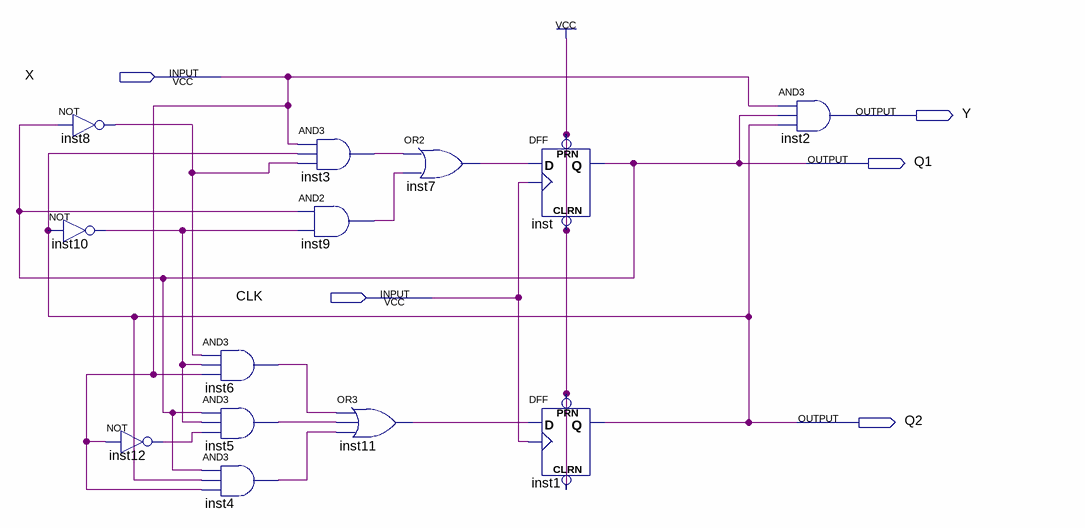
[diagram p0: schematic sheet]
// Quartus schematic SeqDet1101.bdf as structural Verilog: 13 symbols, 5 pins
module SeqDet1101 (
  input  X,
  input  CLK,
  output Y,
  output Q1,
  output Q2
);

  wire inst3_out, inst4_out, inst5_out, inst6_out, inst7_out, inst8_out, inst9_out, inst10_out, inst11_out,
       inst12_out;

  not inst8 (inst8_out, Q1);
  not inst10 (inst10_out, Q2);
  not inst12 (inst12_out, X);
  and inst6 (inst6_out, inst8_out, inst10_out, X);
  and inst5 (inst5_out, Q1, inst10_out, inst12_out);
  and inst4 (inst4_out, Q1, Q2, X);
  and inst3 (inst3_out, X, Q2, inst8_out);
  and inst9 (inst9_out, Q1, inst10_out);
  or inst7 (inst7_out, inst3_out, inst9_out);
  or inst11 (inst11_out, inst6_out, inst5_out, inst4_out);
  DFF inst (.CLRN(1'b1), .CLK(CLK), .D(inst7_out), .PRN(1'b1), .Q(Q1));
  DFF inst1 (.CLRN(1'b1), .CLK(CLK), .D(inst11_out), .PRN(1'b1), .Q(Q2));
  and inst2 (Y, X, Q1, Q2);
endmodule
